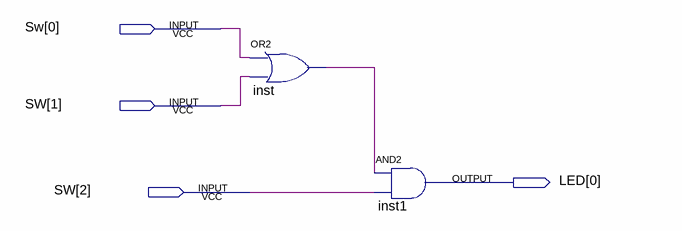
[diagram p0: schematic sheet]
// Quartus schematic EX2.bdf as structural Verilog: 2 symbols, 4 pins
module EX2 (
  input  [2:0] Sw,
  output [0:0] LED
);

  wire inst_out;

  or inst (inst_out, Sw[0], Sw[1]);
  and inst1 (LED[0], inst_out, Sw[2]);
endmodule
